# Altium project MZCAT_BMS.PrjPcb
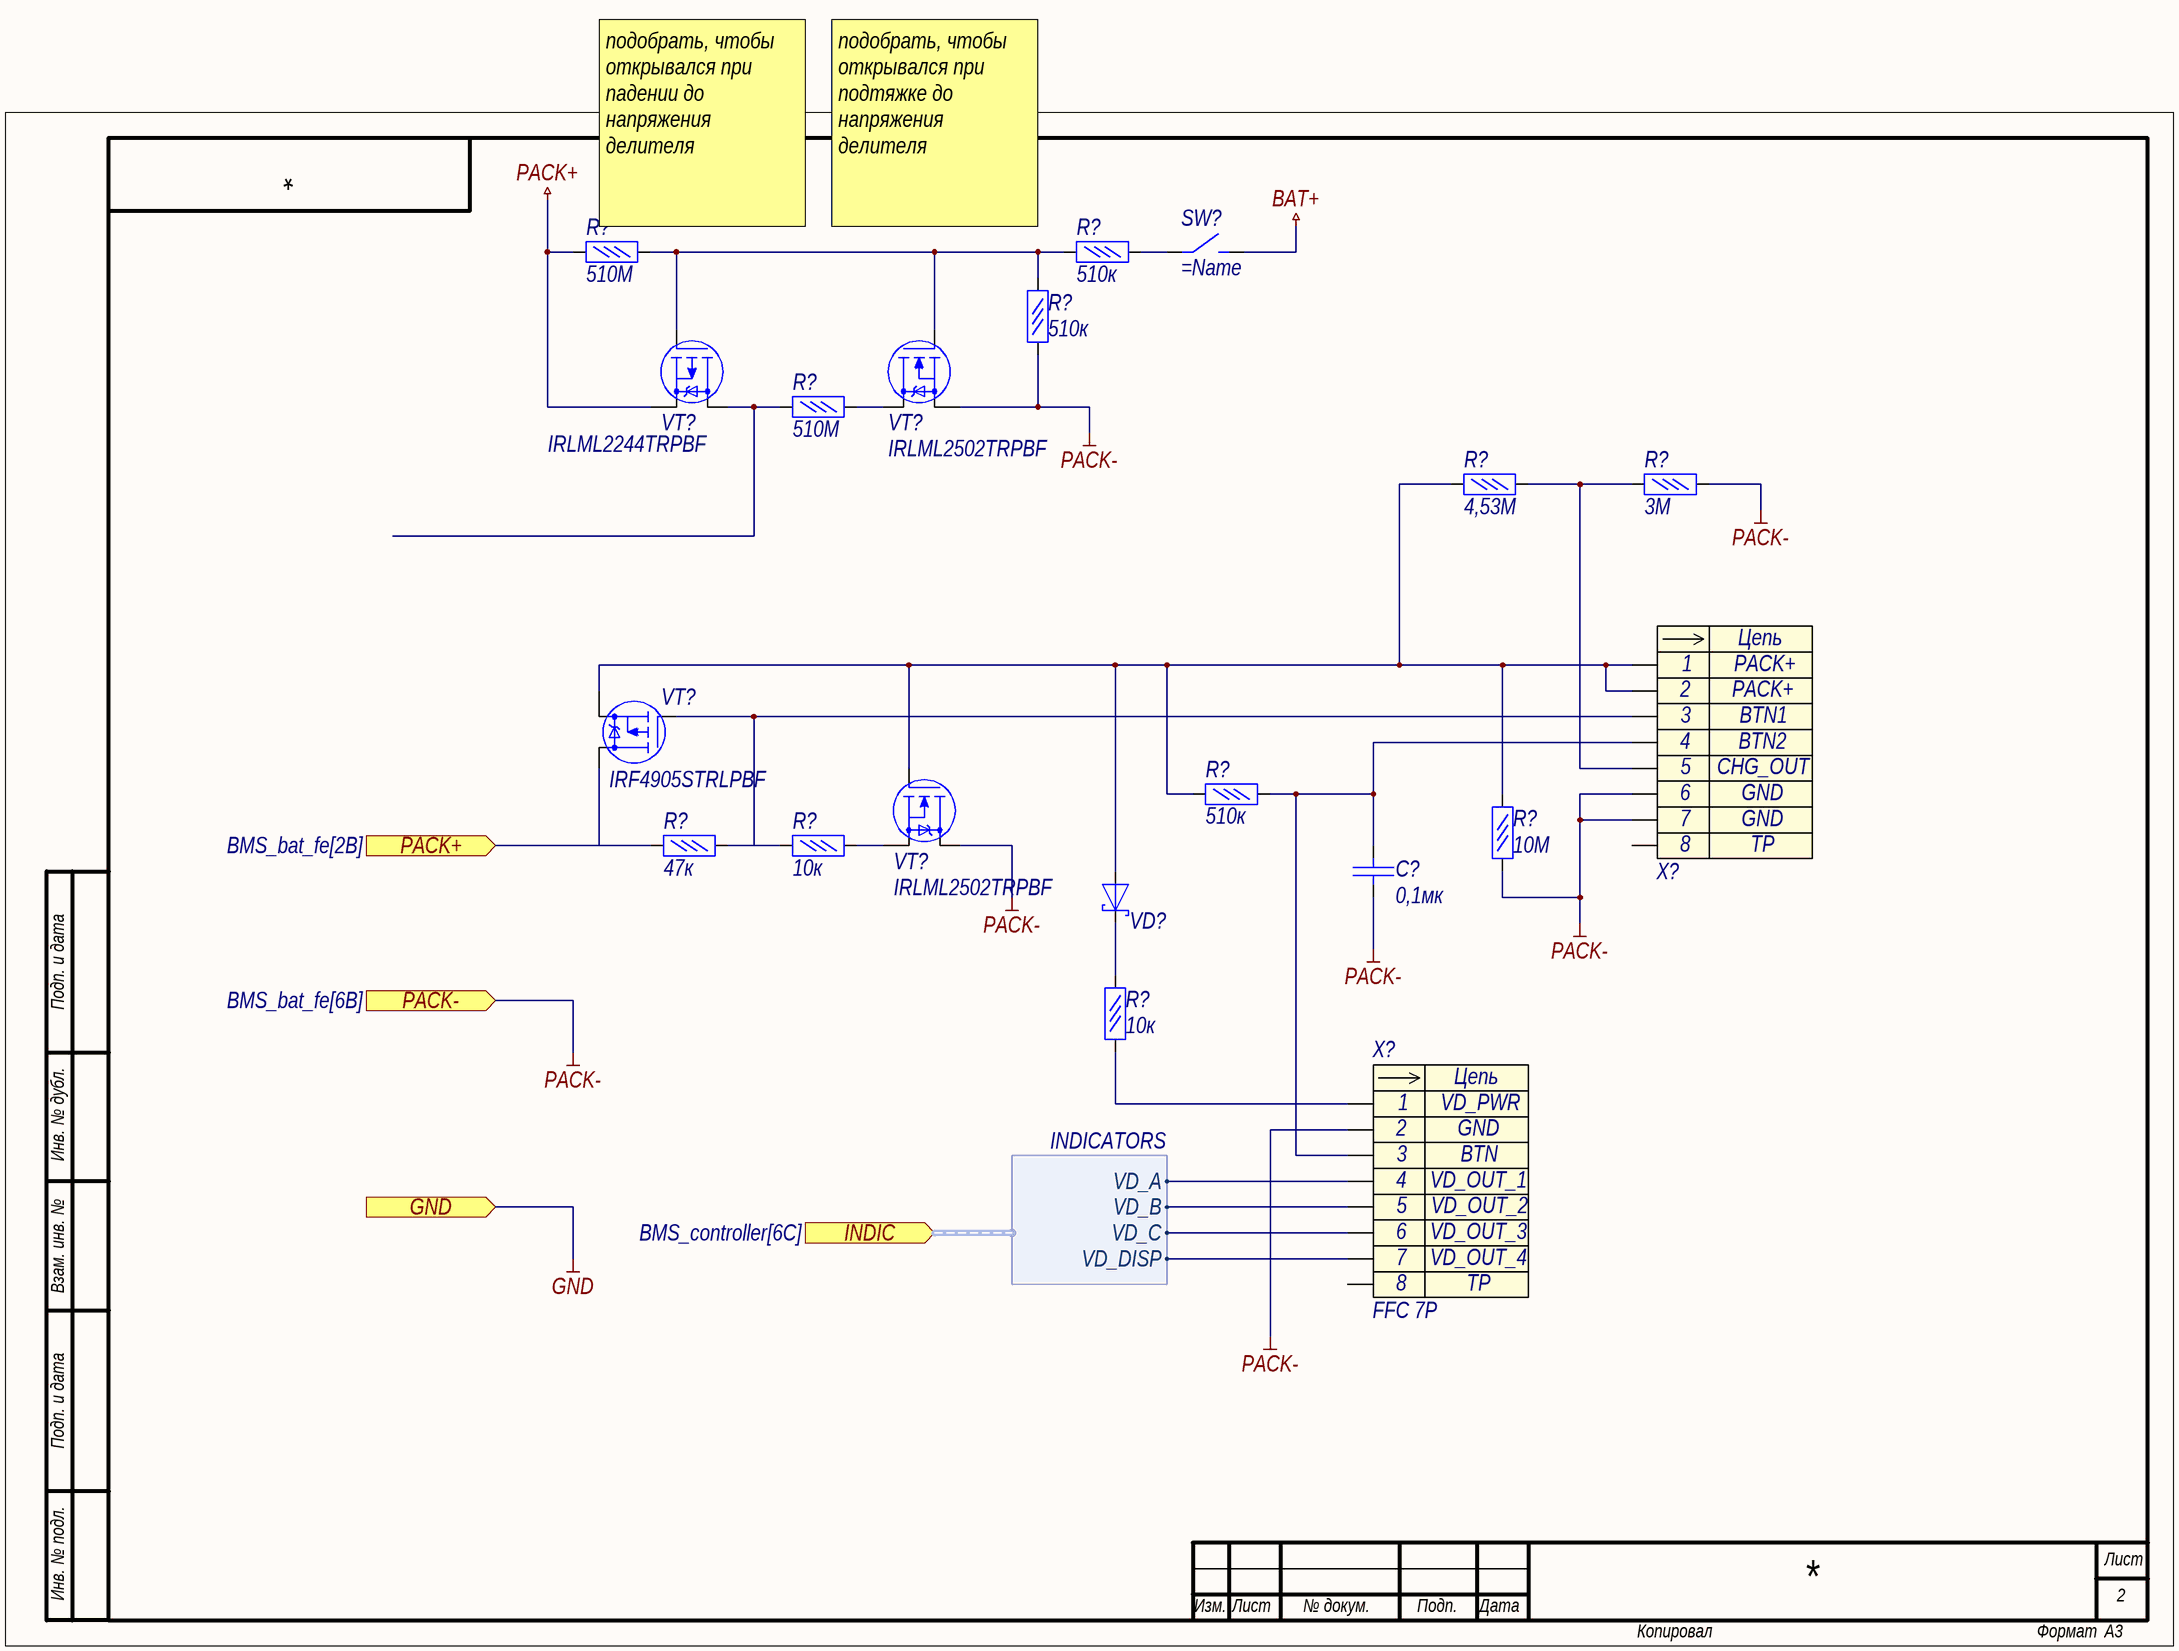
[diagram p0: BMS_peripherial.SchDoc]
5 sheets, 83 parts. Net scope: flat (ports and power ports of the same name join across sheets).
Sheets:
  BMS_main.SchDoc
  BMS_peripherial.SchDoc
  BMS_bat_fe.SchDoc
  BMS_cells.SchDoc
  BMS_controller.SchDoc

## Sheet BMS_main.SchDoc
size 420 x 297 mm; SheetNumber: 1; SheetTotal: 6

### Notes on the sheet
- Подп. и дата
- Инв. № дубл.
- Взам. инв. №
- Инв. № подл.
- Лист
- Изм.
- № докум.
- Подп.
- Дата
- Копировал
- Формат
- А3

## Sheet BMS_peripherial.SchDoc
size 420 x 297 mm; SheetNumber: 2; SheetTotal: 5

### Parts
(Parts that share a designator on the sheet are numbered #1, #2 ... from top to bottom, then left to right.)
R?#1  510М  [R0603]
R?#2  510к  [R0603]
R?#3  510к  [R0603]
R?#4  510М  [R0603]
R?#5  4,53М  [R0603]
R?#6  3М  [R0603]
R?#7  10к  [R0603]
R?#8  510к  [R0603]
R?#9  47к  [R0603]
R?#10  10М  [R0603]
R?#11  10к  [R0603]
SW?  (no value)  [it-1187]
VD?#1  1N5817WS  [SOD323]  (value not drawn)
VT?#1  IRLML2244TRPBF  [SOT23]
VT?#2  IRLML2502TRPBF  [SOT23]
VT?#3  IRF4905STRLPBF  [D2PAK]
VT?#4  IRLML2502TRPBF  [SOT23]
X?#1  (no value)  [2+5P Header]
X?#2  FFC 7P  [LCP UL94-V0]
С?#1  0,1мк  [C0603]

### Ports
GND (in), INDIC (in, harness INDICATORS, see BMS_controller[6C]), PACK+ (in, see BMS_bat_fe[2B]), PACK- (in, see BMS_bat_fe[6B])

### Harnesses
INDICATORS: VD_A, VD_B, VD_C, VD_DISP

### Nets
BAT+: SW?.2
GND: port GND
PACK+: R?#1.2 VT?#1.2(S)
PACK-: R?#3.1 R?#6.1 R?#10.1 VT?#2.2(S) VT?#4.3(D) X?#1.6 X?#1.7 X?#2.2 С?#1.2 ; port PACK-
NetR?#1_1: R?#1.1 R?#2.1 R?#3.2 VT?#1.1(G) VT?#2.1(G)
NetR?#2_2: R?#2.2 SW?.1
NetR?#4_1: R?#4.1 VT?#2.3(D)
NetR?#4_2: R?#4.2 VT?#1.3(D)
NetR?#5_1: R?#5.1 R?#6.2 X?#1.5
NetR?#5_2: R?#5.2 R?#8.1 R?#10.2 VD?#1.2(A) VT?#3.2(S) VT?#4.1(G) X?#1.1 X?#1.2
NetR?#7_1: R?#7.1 VT?#4.2(S)
NetR?#7_2: R?#7.2 R?#9.2 VT?#3.1(G) X?#1.3
NetR?#8_2: R?#8.2 X?#1.4 X?#2.3 С?#1.1
NetR?#9_1: R?#9.1 VT?#3.3(D) ; port PACK+
NetR?#11_1: R?#11.1 X?#2.1
NetR?#11_2: R?#11.2 VD?#1.1(K)
NetR?#22_2: X?#2.4 ; port INDIC.VD_A
NetR?#22_4: X?#2.5 ; port INDIC.VD_B
NetR?#22_6: X?#2.6 ; port INDIC.VD_C
NetR?#22_8: X?#2.7 ; port INDIC.VD_DISP

Not connected (* = marked no-connect by the designer): X?#1 0; X?#2 0

### Notes on the sheet
- (near R?#1) подобрать, чтобы открывался при падении до напряжения делителя
- (near R?#2) подобрать, чтобы открывался при подтяжке до напряжения делителя
- Подп. и дата
- Инв. № дубл.
- Взам. инв. №
- Инв. № подл.
- Лист
- Изм.
- № докум.
- Подп.
- Дата
- Копировал
- Формат
- А3
- (in symbol Header_7) Цепь; 8

### Library data of the parts
R?#1-R?#11 = Резистор 0.05Вт: Резистор 0,05Вт
  R?#1 R?#4: Value: 510М
  R?#2 R?#3 R?#8: Value: 510к
  R?#5: Value: 4,53М
  R?#6: Value: 3М
  R?#7 R?#11: Value: 10к
  R?#9: Value: 47к
  R?#10: Value: 10М
SW? = button
VD?#1 = Diode Shottky: Диод Шоттки; Name: 1N5817WS
VT?#1 = IRLML2244TRPBF: мосфет p-канал IRLML2244TRPBF; Name: IRLML2244TRPBF
VT?#2 VT?#4 = IRLML2502TRPBF: мосфет n-канал IRLML2502TRPBF; Name: IRLML2502TRPBF
VT?#3 = IRFR5305TRPBF: Транзистор полевой P-канальный -55В -31А 110Вт 0,065Ом; Name: IRF4905STRLPBF
X?#1 = Header_7: Разъем - 7 конт. мама; Contact_1: PACK+; Contact_3: BTN1; Contact_4: BTN2; Contact_5: CHG_OUT; Contact_6: GND; Contact_8: TP; Contact_2: PACK+; Contact_7: GND
X?#2 = Header_7: Разъем - 7 конт. мама; Contact_1: VD_PWR; Contact_2: GND; Contact_3: BTN; Contact_4: VD_OUT_1; Contact_5: VD_OUT_2; Contact_6: VD_OUT_3; Contact_7: VD_OUT_4; Contact_8: TP; Name: FFC 7P
С?#1 = Кер. конденсатор: Value: 0,1мк

## Sheet BMS_bat_fe.SchDoc
size 420 x 297 mm; SheetNumber: 3; SheetTotal: 5
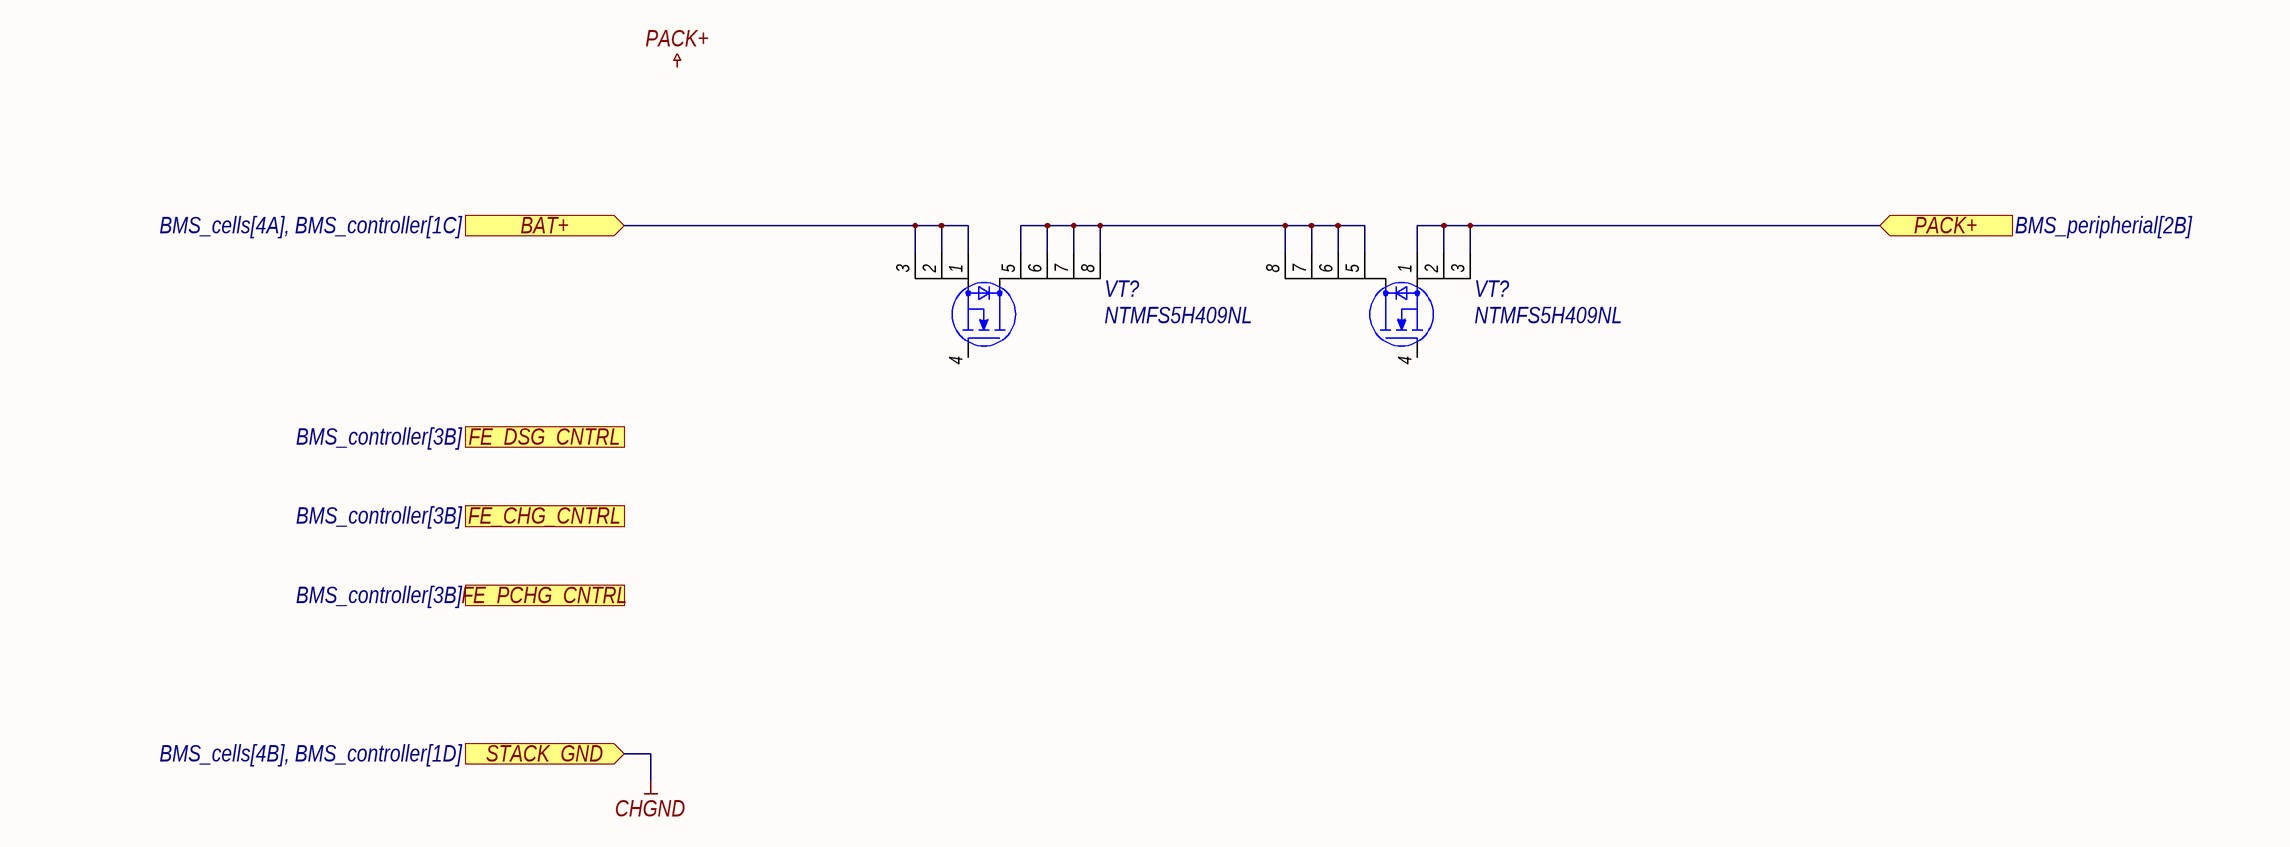
[diagram p1: BMS_bat_fe.SchDoc]

### Parts
(Parts that share a designator on the sheet are numbered #1, #2 ... from top to bottom, then left to right.)
VT?#5  NTMFS5H409NL  [DFN5]
VT?#6  NTMFS5H409NL  [DFN5]

### Ports
BAT+ (in, see BMS_cells[4A], BMS_controller[1C]), FE_CHG_CNTRL (in, see BMS_controller[3B]), FE_DSG_CNTRL (in, see BMS_controller[3B]), FE_PCHG_CNTRL (in, see BMS_controller[3B]), PACK+ (in, see BMS_peripherial[2B]), STACK_GND (in, see BMS_cells[4B], BMS_controller[1D])

### Nets
NetFU?_2: VT?#5.1(S) VT?#5.2(S) VT?#5.3(S) ; port BAT+
NetR?#9_1: VT?#6.1(S) VT?#6.2(S) VT?#6.3(S) ; port PACK+
NetVT?#5_5: VT?#5.5(D) VT?#5.6(D) VT?#5.7(D) VT?#5.8(D) VT?#6.5(D) VT?#6.6(D) VT?#6.7(D) VT?#6.8(D)

Not connected (* = marked no-connect by the designer): VT?#5 4(G); VT?#6 4(G)

### Notes on the sheet
- Labels drawn without touching a wire or pin: PACK+
- Подп. и дата
- Инв. № дубл.
- Взам. инв. №
- Инв. № подл.
- Лист
- Изм.
- № докум.
- Подп.
- Дата
- Копировал
- Формат
- А3

### Library data of the parts
VT?#5 VT?#6 = NTMFS5H409NL: 40 V, 1.1 m, 270 A, Single N−Channel; Name: NTMFS5H409NL

## Sheet BMS_cells.SchDoc
size 420 x 297 mm; SheetNumber: 5; SheetTotal: 6
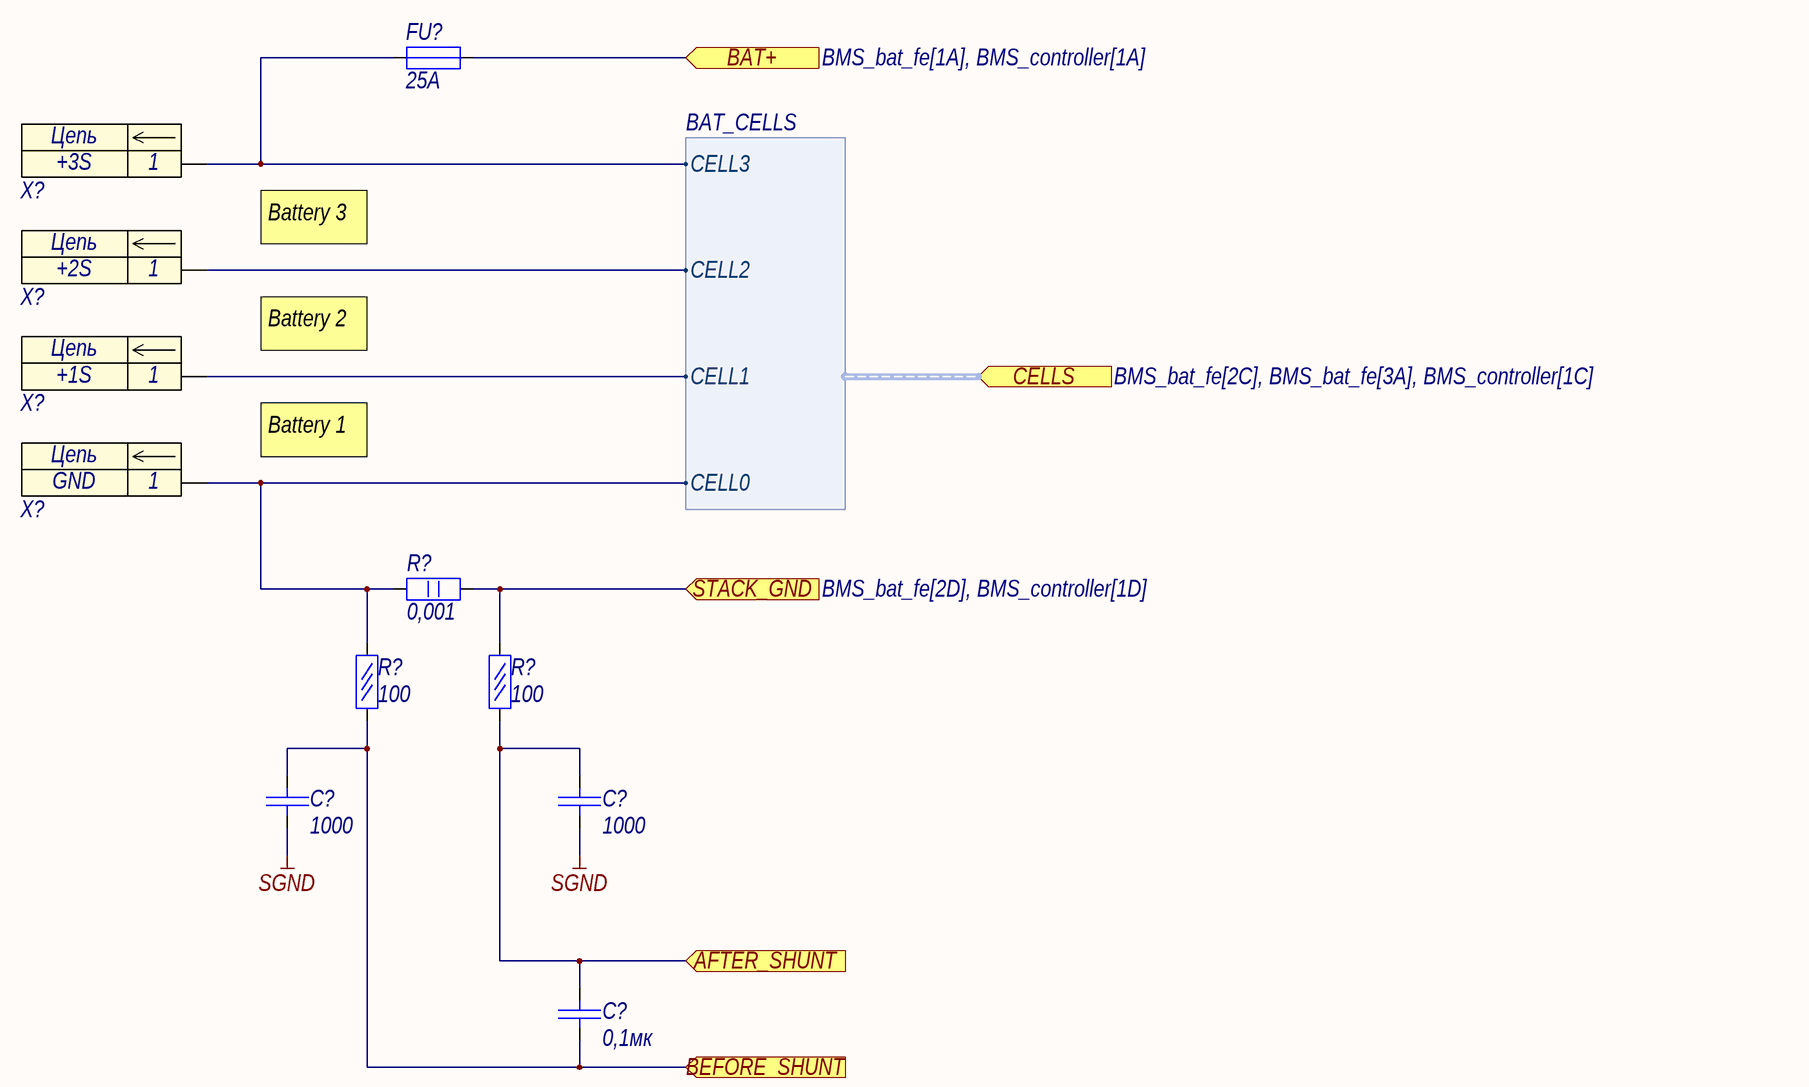
[diagram p2: BMS_cells.SchDoc]

### Parts
(Parts that share a designator on the sheet are numbered #1, #2 ... from top to bottom, then left to right.)
FU?  25A  [F1206]
R?#12  0,001  [R2512]
R?#13  100  [R0603]
R?#14  100  [R0603]
X?#3  (no value)  [PAD 10 X 5]
X?#4  (no value)  [PAD 10 X 5]
X?#5  (no value)  [PAD 10 X 5]
X?#6  (no value)  [PAD 10 X 5]
С?#2  1000  [C0603]
С?#3  1000  [C0603]
С?#4  0,1мк  [C0603]

### Ports
AFTER_SHUNT (in), BAT+ (in, see BMS_bat_fe[1A], BMS_controller[1A]), BEFORE_SHUNT (in), CELLS (in, harness BAT_CELLS, see BMS_bat_fe[2C], BMS_bat_fe[3A], BMS_controller[1C]), STACK_GND (in, see BMS_bat_fe[2D], BMS_controller[1D])

### Harnesses
BAT_CELLS: CELL0, CELL1, CELL2, CELL3

### Nets
CHGND: R?#12.2 R?#14.2 ; port STACK_GND
SGND: R?#12.1 R?#13.2 X?#6.1 С?#2.1 С?#3.1 ; port CELLS.CELL0
NetDD?#2_6: R?#14.1 С?#3.2 С?#4.2 ; port AFTER_SHUNT
NetDD?#2_8: R?#13.1 С?#2.2 С?#4.1 ; port BEFORE_SHUNT
NetFU?_1: FU?.1 X?#3.1 ; port CELLS.CELL3
NetFU?_2: FU?.2 ; port BAT+
NetR?#19_1: X?#4.1 ; port CELLS.CELL2
NetR?#20_1: X?#5.1 ; port CELLS.CELL1

### Notes on the sheet
- Battery 3
- Battery 2
- Battery 1
- Подп. и дата
- Инв. № дубл.
- Взам. инв. №
- Инв. № подл.
- Лист
- Изм.
- № докум.
- Подп.
- Дата
- Копировал
- Формат
- А3
- (in symbol Contact) Цепь

### Library data of the parts
FU? = Предохранитель: Предохранитель 2Вт; Name: CC12H1.5A; Value: 25A
R?#12 = Резистор 2Вт: Value: 0,001
R?#13 R?#14 = Резистор 0.05Вт: Резистор 0,05Вт; Value: 100
X?#3 = Contact: Контакт; Contact_1: +3S
X?#4 = Contact: Контакт; Contact_1: +2S
X?#5 = Contact: Контакт; Contact_1: +1S
X?#6 = Contact: Контакт; Contact_1: GND
С?#2-С?#4 = Кер. конденсатор
  С?#2 С?#3: Value: 1000
  С?#4: Value: 0,1мк

## Sheet BMS_controller.SchDoc
size 594 x 420 mm; SheetNumber: 5; SheetTotal: 5
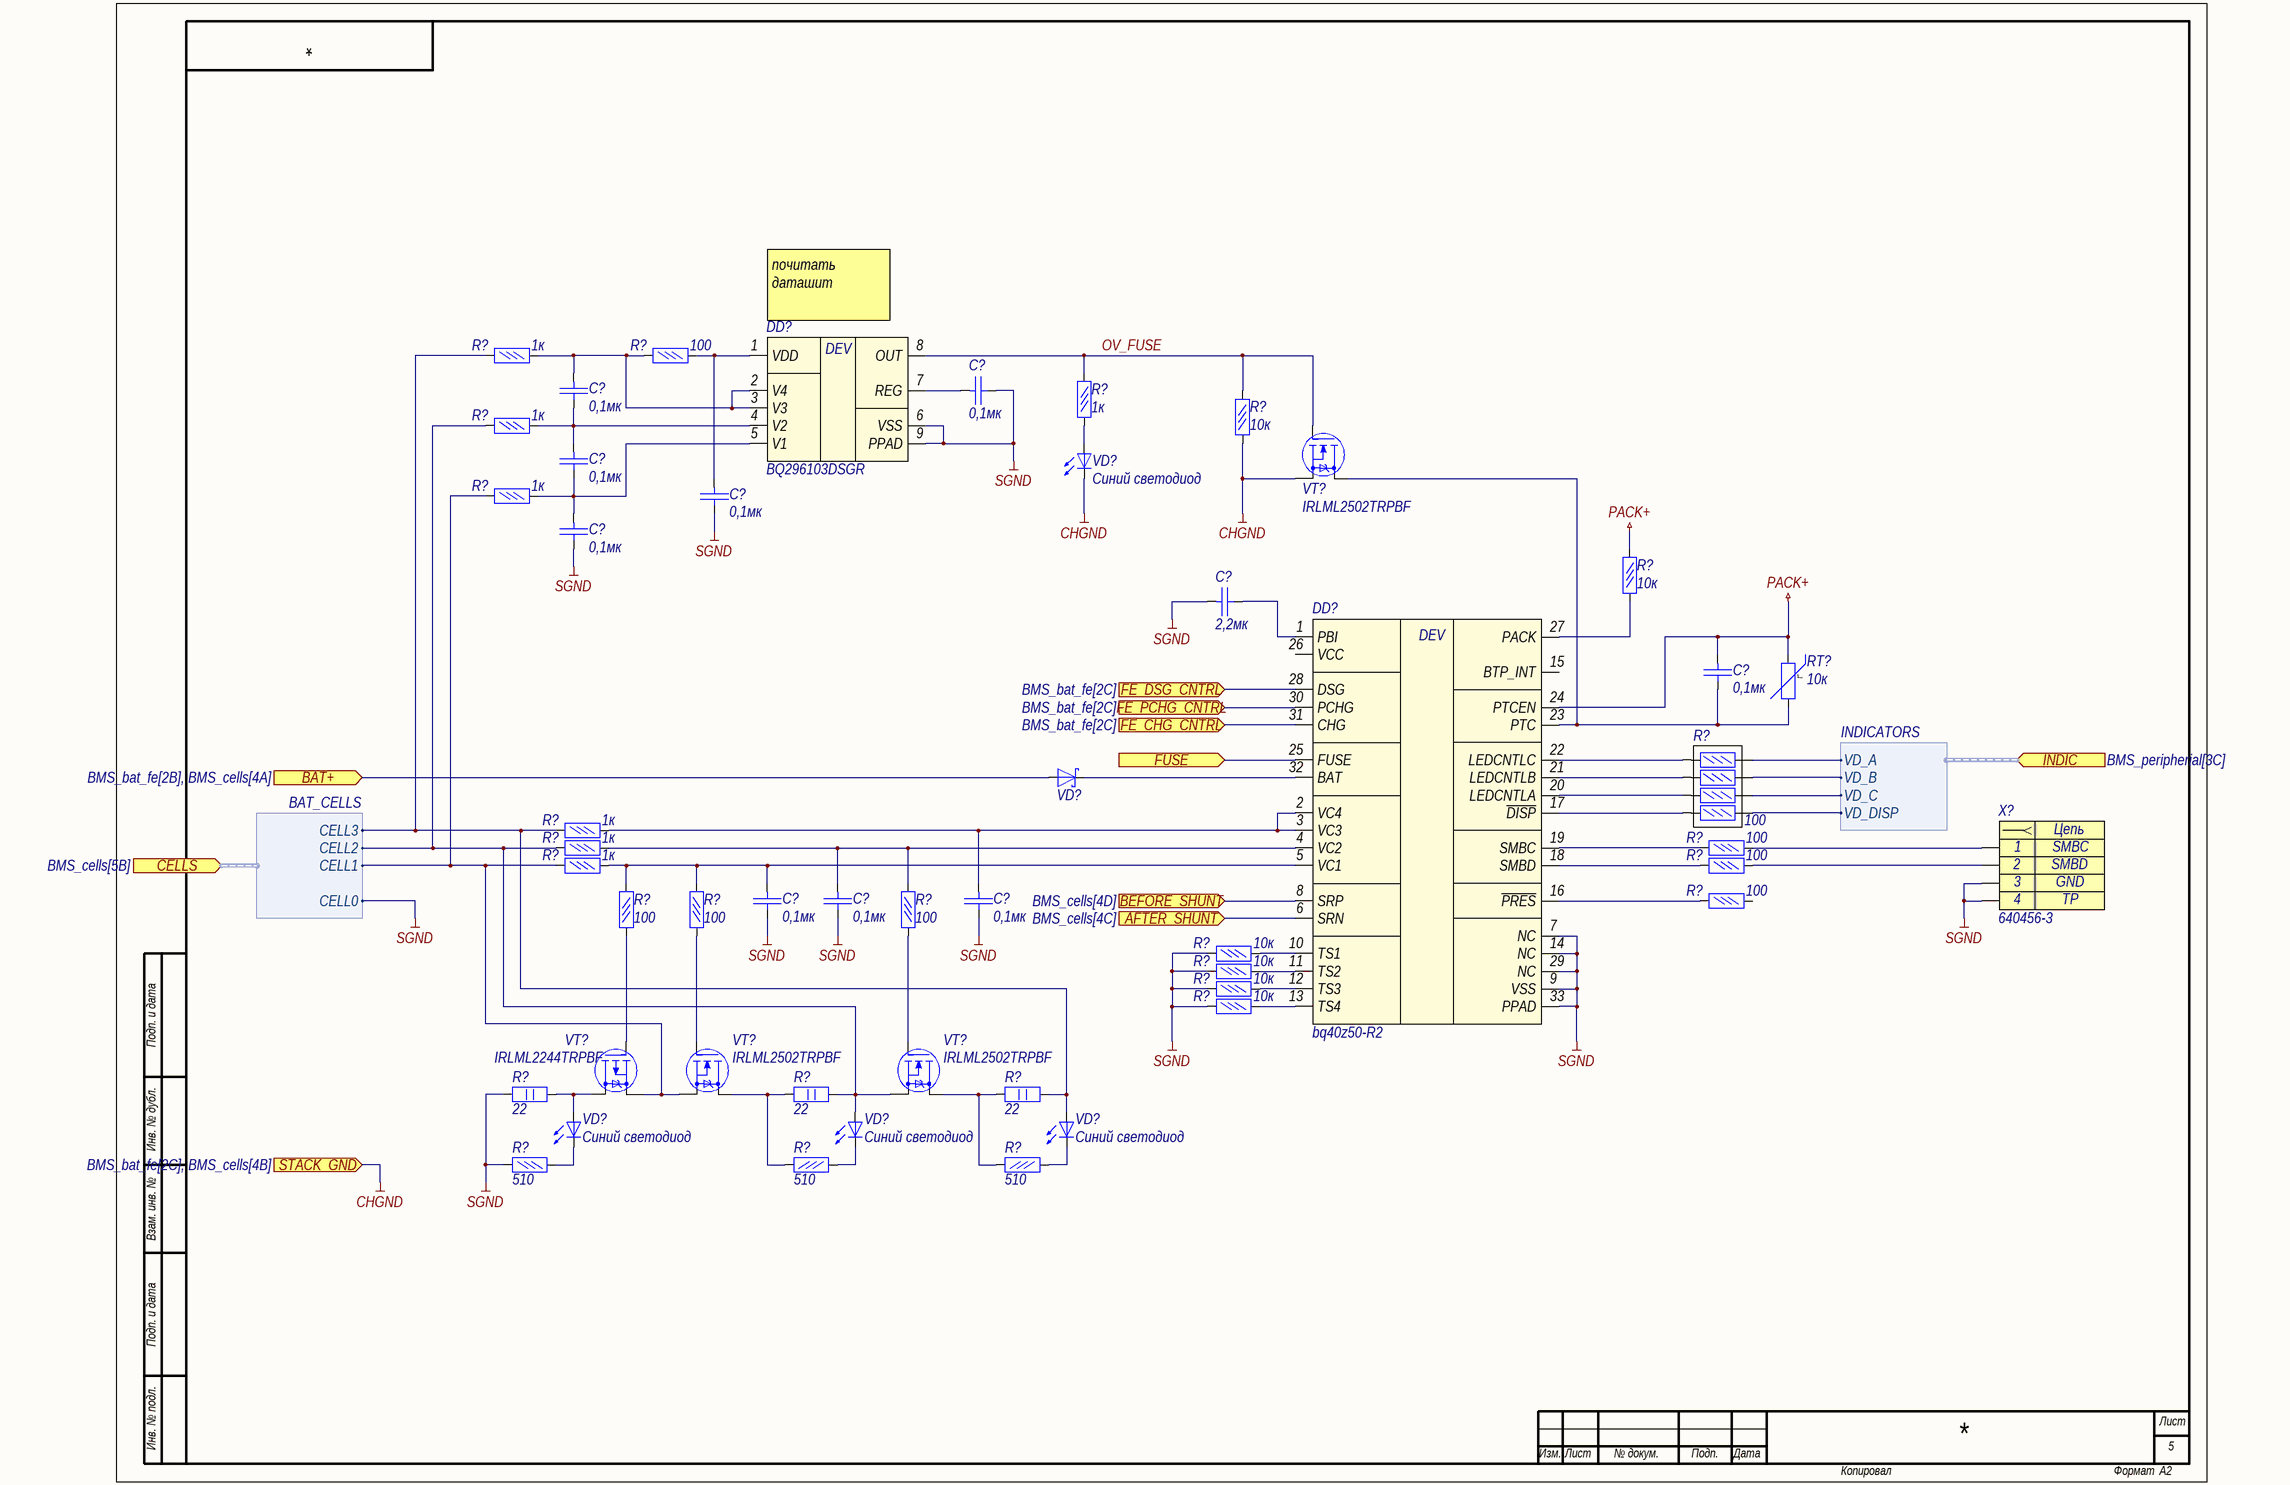
[diagram p3: BMS_controller.SchDoc]

### Parts
(Parts that share a designator on the sheet are numbered #1, #2 ... from top to bottom, then left to right.)
DD?#1  BQ296103DSGR  [WSON-8]
DD?#2  bq40z50-R2  [RSM (S-PVQFN-N32)]
R?#15  1к  [R0603]
R?#16  100  [R0603]
R?#17  10к  [R0603]
R?#18  1к  [R0603]
R?#19  1к  [R0603]
R?#20  1к  [R0603]
R?#21  10к  [R0603]
R?#22  100  [R0603X4]
R?#23  1к  [R0603]
R?#24  1к  [R0603]
R?#25  100  [R0603]
R?#26  1к  [R0603]
R?#27  100  [R0603]
R?#28  100  [R0603]
R?#29  100  [R0603]
R?#30  100  [R0603]
R?#31  100  [R0603]
R?#32  10к  [R0603]
R?#33  10к  [R0603]
R?#34  10к  [R0603]
R?#35  10к  [R0603]
R?#36  22  [R2512]
R?#37  22  [R2512]
R?#38  22  [R2512]
R?#39  510  [R0603]
R?#40  510  [R0603]
R?#41  510  [R0603]
RT?  10к  [R1206]
VD?#2  Синий светодиод  [0603 - led]
VD?#3  *  [SOD323]  (value not drawn)
VD?#4  Синий светодиод  [0603 - led]
VD?#5  Синий светодиод  [0603 - led]
VD?#6  Синий светодиод  [0603 - led]
VT?#7  IRLML2502TRPBF  [SOT23]
VT?#8  IRLML2244TRPBF  [SOT23]
VT?#9  IRLML2502TRPBF  [SOT23]
VT?#10  IRLML2502TRPBF  [SOT23]
X?#7  640456-3  [JST-640456-3]
С?#5  0,1мк  [C0603]
С?#6  0,1мк  [C0603]
С?#7  0,1мк  [C0603]
С?#8  0,1мк  [C0603]
С?#9  0,1мк  [C0603]
С?#10  2,2мк  [C0603]
С?#11  0,1мк  [C0603]
С?#12  0,1мк  [C0603]
С?#13  0,1мк  [C0603]
С?#14  0,1мк  [C0603]

### Ports
AFTER_SHUNT (in, see BMS_cells[4C]), BAT+ (in, see BMS_bat_fe[2B], BMS_cells[4A]), BEFORE_SHUNT (in, see BMS_cells[4D]), CELLS (in, harness BAT_CELLS, see BMS_cells[5B]), FE_CHG_CNTRL (in, see BMS_bat_fe[2C]), FE_DSG_CNTRL (in, see BMS_bat_fe[2C]), FE_PCHG_CNTRL (in, see BMS_bat_fe[2C]), FUSE (in), INDIC (in, harness INDICATORS, see BMS_peripherial[3C]), STACK_GND (in, see BMS_bat_fe[2C], BMS_cells[4B])

### Harnesses
BAT_CELLS: CELL0, CELL1, CELL2, CELL3
INDICATORS: VD_A, VD_B, VD_C, VD_DISP

### Nets
CHGND: R?#17.2 VD?#2.2(K) VT?#7.2(S) ; port STACK_GND
PACK+: DD?#2.24(PTCEN) R?#21.2 RT?.1 С?#11.2
SGND: DD?#1.6(VSS) DD?#1.9(PPAD) DD?#2.7(NC) DD?#2.9(VSS) DD?#2.14(NC) DD?#2.29(NC) DD?#2.33(PPAD) R?#32.1 R?#33.1 R?#34.1 R?#35.1 R?#36.2 R?#39.2 X?#7.0 X?#7.3 С?#5.1 С?#8.1 С?#9.1 С?#10.2 С?#12.1 С?#13.1 С?#14.1 ; port CELLS.CELL0
OV_FUSE: DD?#1.8(OUT) R?#17.1 R?#18.2 VT?#7.1(G)
NetDD?#1_1: DD?#1.1(VDD) R?#16.2 С?#8.2
NetDD?#1_2: DD?#1.2(V4) DD?#1.3(V3) R?#15.2 R?#16.1 С?#6.2
NetDD?#1_4: DD?#1.4(V2) R?#19.2 С?#6.1 С?#7.2
NetDD?#1_5: DD?#1.5(V1) R?#20.2 С?#7.1 С?#9.2
NetDD?#1_7: DD?#1.7(REG) С?#5.2
NetDD?#2_1: DD?#2.1(NC) С?#10.1
NetDD?#2_2: DD?#2.2(VC4) DD?#2.3(VC3) R?#23.2 С?#14.2
NetDD?#2_4: DD?#2.4(VC2) R?#24.2 R?#29.1 С?#13.2
NetDD?#2_5: DD?#2.5(VC1) R?#26.2 R?#27.1 R?#28.1 С?#12.2
NetDD?#2_6: DD?#2.6(SRN) ; port AFTER_SHUNT
NetDD?#2_8: DD?#2.8(SRP) ; port BEFORE_SHUNT
NetDD?#2_10: DD?#2.10(TS1) R?#32.2
NetDD?#2_11: DD?#2.11(TS2) R?#33.2
NetDD?#2_12: DD?#2.12(NC) R?#34.2
NetDD?#2_13: DD?#2.13(TS4) R?#35.2
NetDD?#2_16: DD?#2.16(~{PRES}) R?#31.1
NetDD?#2_17: DD?#2.17(~{DISP}) R?#22.7
NetDD?#2_18: DD?#2.18(SMBD) R?#30.1
NetDD?#2_19: DD?#2.19(SMBC) R?#25.1
NetDD?#2_20: DD?#2.20(LEDCNTLA) R?#22.5
NetDD?#2_21: DD?#2.21(LEDCNTLB) R?#22.3
NetDD?#2_22: DD?#2.22(LEDCNTLC) R?#22.1
NetDD?#2_23: DD?#2.23(PTC) RT?.2 VT?#7.3(D) С?#11.1
NetDD?#2_25: DD?#2.25(FUSE) ; port FUSE
NetDD?#2_27: DD?#2.27(PACK) R?#21.1
NetDD?#2_28: DD?#2.28(NC) ; port FE_DSG_CNTRL
NetDD?#2_30: DD?#2.30(PCHG) ; port FE_PCHG_CNTRL
NetDD?#2_31: DD?#2.31(CHG) ; port FE_CHG_CNTRL
NetDD?#2_32: DD?#2.32(BAT) VD?#3.1(K)
NetFU?_1: R?#15.1 R?#23.1 R?#38.2 VD?#6.1(A) ; port CELLS.CELL3
NetFU?_2: VD?#3.2(A) ; port BAT+
NetR?#18_1: R?#18.1 VD?#2.1(A)
NetR?#19_1: R?#19.1 R?#24.1 R?#37.2 VD?#5.1(A) VT?#10.2(S) ; port CELLS.CELL2
NetR?#20_1: R?#20.1 R?#26.1 VT?#8.2(S) VT?#9.2(S) ; port CELLS.CELL1
NetR?#22_2: R?#22.2 ; port INDIC.VD_A
NetR?#22_4: R?#22.4 ; port INDIC.VD_B
NetR?#22_6: R?#22.6 ; port INDIC.VD_C
NetR?#22_8: R?#22.8 ; port INDIC.VD_DISP
NetR?#25_2: R?#25.2 X?#7.1
NetR?#27_2: R?#27.2 VT?#8.1(G)
NetR?#28_2: R?#28.2 VT?#9.1(G)
NetR?#29_2: R?#29.2 VT?#10.1(G)
NetR?#30_2: R?#30.2 X?#7.2
NetR?#36_1: R?#36.1 VD?#4.1(A) VT?#8.3(D)
NetR?#37_1: R?#37.1 R?#40.2 VT?#9.3(D)
NetR?#38_1: R?#38.1 R?#41.2 VT?#10.3(D)
NetR?#39_1: R?#39.1 VD?#4.2(K)
NetR?#40_1: R?#40.1 VD?#5.2(K)
NetR?#41_1: R?#41.1 VD?#6.2(K)

Not connected (* = marked no-connect by the designer): DD?#1 15(NC) 18(NC) 27(NC); DD?#2 15(NC) 26(VCC); R?#31 2

### Notes on the sheet
- (near DD?#1) почитать даташит
- Подп. и дата
- Инв. № дубл.
- Взам. инв. №
- Инв. № подл.
- Лист
- Изм.
- № докум.
- Подп.
- Дата
- Копировал
- Формат
- А2
- (in symbol bq40z50-R1) DEV
- (in symbol BQ296103DSGR) DEV
- (in symbol Header_3) Цепь; 4
- (in symbol Термистор) t°

### Library data of the parts
DD?#1 = BQ296103DSGR: x Overvoltage Protection for 2-Series, 3-Series, and 4-Series Cell  Li-Ion Batteries; Name: BQ296103DSGR
DD?#2 = bq40z50-R1: Name: bq40z50-R2
R?#15-R?#21 R?#23-R?#35 R?#39-R?#41 = Резистор 0.05Вт: Резистор 0,05Вт
  R?#15 R?#18-R?#20 R?#23 R?#24 R?#26: Value: 1к
  R?#16 R?#25 R?#27-R?#31: Value: 100
  R?#17 R?#21 R?#32-R?#35: Value: 10к
  R?#39-R?#41: Value: 510
R?#22 = Резисторная сборка 0.05 x 4: Value: 100
R?#36-R?#38 = Резистор 2Вт: Value: 22
RT? = Термистор: Value: 10к
VD?#2 VD?#4-VD?#6 = SMD светодиод: Светодтод SMD; Name: Синий светодиод
VD?#3 = Diode Shottky: Диод Шоттки; Name: *
VT?#7 VT?#9 VT?#10 = IRLML2502TRPBF: мосфет n-канал IRLML2502TRPBF; Name: IRLML2502TRPBF
VT?#8 = IRLML2244TRPBF: мосфет p-канал IRLML2244TRPBF; Name: IRLML2244TRPBF
X?#7 = Header_3: Разъем - 3 конт. розетка; Contact_1: SMBC; Contact_2: SMBD; Contact_3: GND; Contact_4: TP; Name: 640456-3
С?#5-С?#14 = Кер. конденсатор
  С?#5-С?#9 С?#11-С?#14: Value: 0,1мк
  С?#10: Value: 2,2мк

## Nets that join several sheets
CHGND: BMS_cells (R?#12.2 R?#14.2), BMS_controller (R?#17.2 VD?#2.2 VT?#7.2)
PACK+: BMS_peripherial (R?#1.2 VT?#1.2), BMS_controller (DD?#2.24 R?#21.2 RT?.1 С?#11.2)
SGND: BMS_cells (5 pins), BMS_controller (22 pins)
NetDD?#2_6: BMS_cells (R?#14.1 С?#3.2 С?#4.2), BMS_controller (DD?#2.6)
NetDD?#2_8: BMS_cells (R?#13.1 С?#2.2 С?#4.1), BMS_controller (DD?#2.8)
NetFU?_1: BMS_cells (FU?.1 X?#3.1), BMS_controller (R?#15.1 R?#23.1 R?#38.2 VD?#6.1)
NetFU?_2: BMS_bat_fe (VT?#5.1 VT?#5.2 VT?#5.3), BMS_cells (FU?.2), BMS_controller (VD?#3.2)
NetR?#9_1: BMS_peripherial (R?#9.1 VT?#3.3), BMS_bat_fe (VT?#6.1 VT?#6.2 VT?#6.3)
NetR?#19_1: BMS_cells (X?#4.1), BMS_controller (5 pins)
NetR?#20_1: BMS_cells (X?#5.1), BMS_controller (R?#20.1 R?#26.1 VT?#8.2 VT?#9.2)
NetR?#22_2: BMS_peripherial (X?#2.4), BMS_controller (R?#22.2)
NetR?#22_4: BMS_peripherial (X?#2.5), BMS_controller (R?#22.4)
NetR?#22_6: BMS_peripherial (X?#2.6), BMS_controller (R?#22.6)
NetR?#22_8: BMS_peripherial (X?#2.7), BMS_controller (R?#22.8)